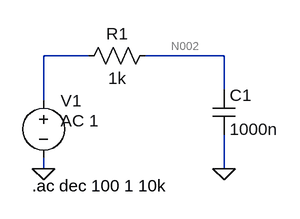
[diagram p0: schematic RC.asc]
RC.asc, the LTspice schematic file:
Version 4
SHEET 1 880 680
WIRE 128 80 64 80
WIRE 320 80 208 80
WIRE 320 128 320 80
WIRE 64 144 64 80
WIRE 64 240 64 224
WIRE 320 240 320 192
FLAG 64 240 0
FLAG 320 240 0
SYMBOL res 224 64 R90
WINDOW 0 0 56 VBottom 2
WINDOW 3 32 56 VTop 2
SYMATTR InstName R1
SYMATTR Value 1k
SYMBOL cap 304 128 R0
SYMATTR InstName C1
SYMATTR Value 1000n
SYMBOL voltage 64 128 R0
WINDOW 3 24 96 Invisible 2
WINDOW 123 24 44 Left 2
WINDOW 39 0 0 Left 2
SYMATTR Value ""
SYMATTR Value2 AC 1
SYMATTR InstName V1
TEXT 48 264 Left 2 !.ac dec 100 1 10k

The netlist it stands for:
* RC.asc
R1 N002 N001 1k
C1 N002 0 1000n
V1 N001 0 AC 1
.ac dec 100 1 10k
.backanno
.end

* Results of the author's LTspice run, read from the files saved beside the schematic
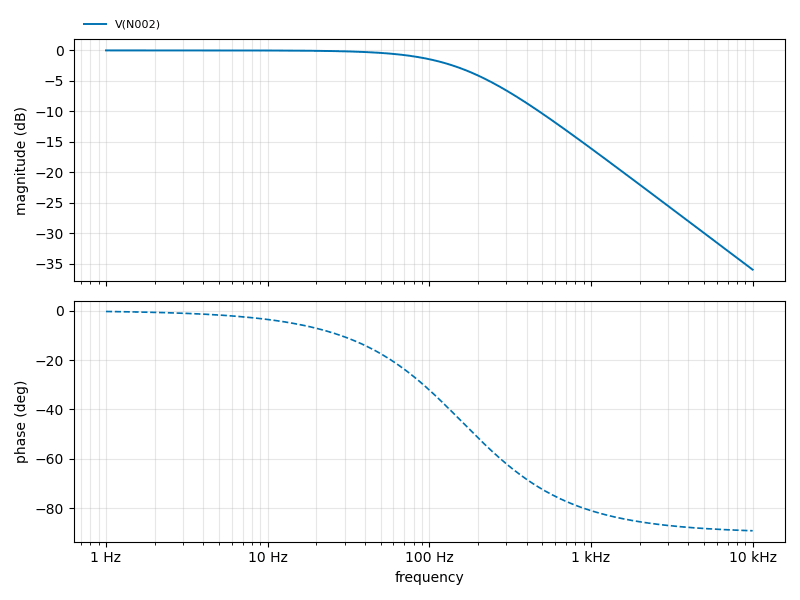
[diagram p1: AC Analysis of RC.asc, plotted from the saved traces]
* AC Analysis, 1 run:
*   V(N002): -0.00 dB at 1 Hz, -35.96 dB at 10 kHz, peak -0.00 dB at 1 Hz, 3 dB below the peak at 159.2 Hz